# Altium schematic sheet Sheet1.SchDoc
size A
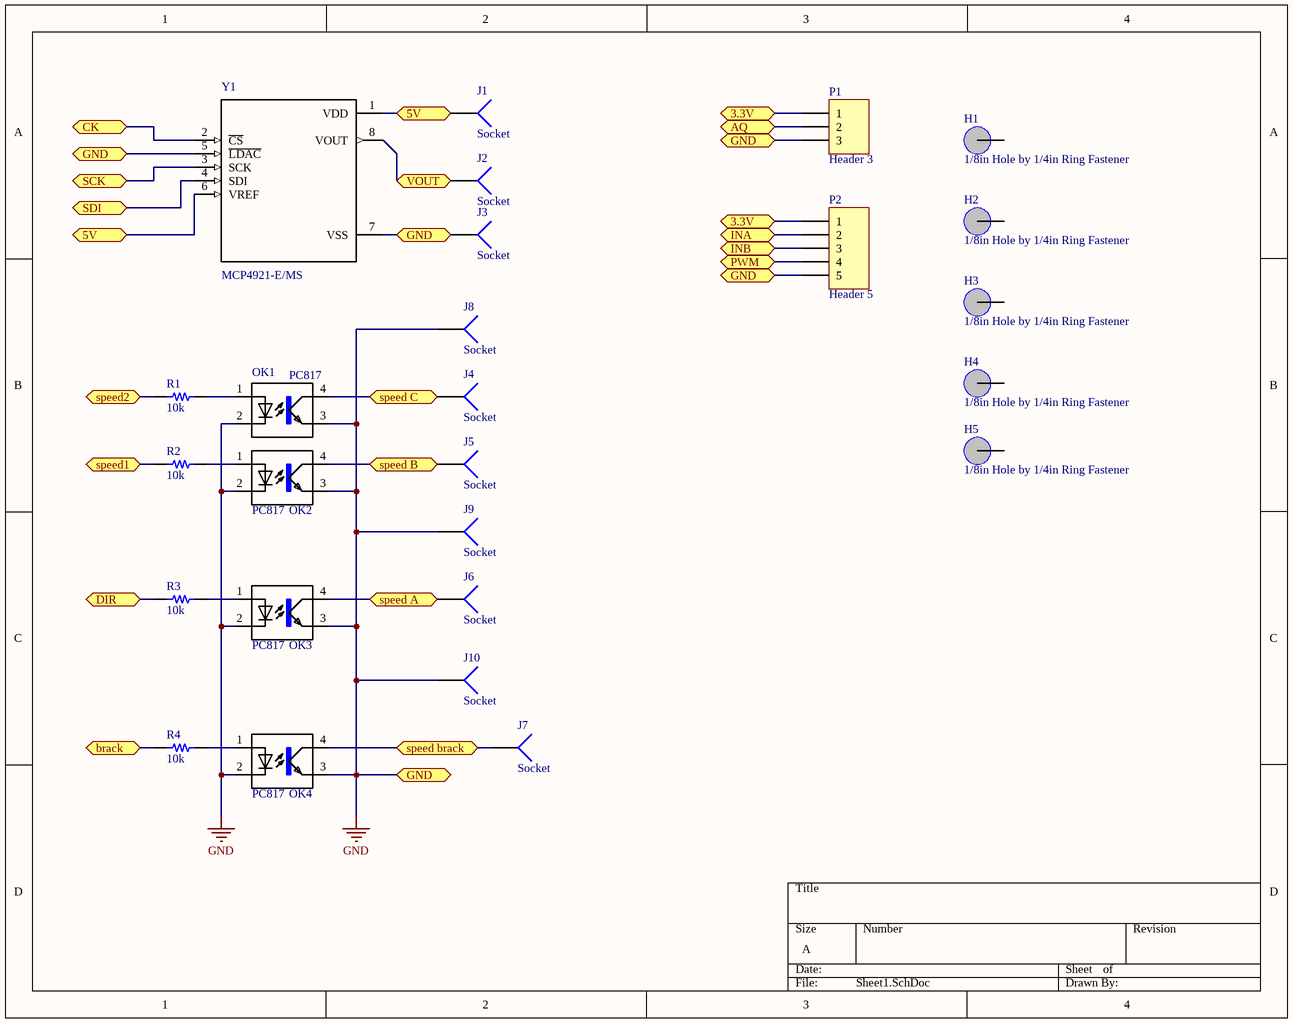
[diagram p0: Sheet1.SchDoc]

## Parts
H1  1/8in Hole by 1/4in Ring Fastener  [1/8in Fastener Hole]
H2  1/8in Hole by 1/4in Ring Fastener  [1/8in Fastener Hole]
H3  1/8in Hole by 1/4in Ring Fastener  [1/8in Fastener Hole]
H4  1/8in Hole by 1/4in Ring Fastener  [1/8in Fastener Hole]
H5  1/8in Hole by 1/4in Ring Fastener  [1/8in Fastener Hole]
J1  Socket  [PIN1]
J2  Socket  [PIN1]
J3  Socket  [PIN1]
J4  Socket  [PIN1]
J5  Socket  [PIN1]
J6  Socket  [PIN1]
J7  Socket  [PIN1]
J8  Socket  [PIN1]
J9  Socket  [PIN1]
J10  Socket  [PIN1]
OK1  PC817  [LITEON LTV-817]
OK2  PC817  [LITEON LTV-817]
OK3  PC817  [LITEON LTV-817]
OK4  PC817  [LITEON LTV-817]
P1  Header 3  [HDR1X3]
P2  Header 5  [HDR1X5]
R1  10k  [0805R-220]
R2  10k  [0805R-220]
R3  10k  [0805R-220]
R4  10k  [0805R-220]
Y1  MCP4921-E/MS  [SOIC127P600X175-8L]

## Ports
3.3V (bidir), 5V (bidir), AQ (bidir), brack (bidir), CK (bidir), DIR (bidir), GND (bidir), INA (bidir), INB (bidir), PWM (bidir), SCK (bidir), SDI (bidir), speed1 (bidir), speed2 (bidir), speed A (bidir), speed B (bidir), speed brack (bidir), speed C (bidir), VOUT (bidir)

## Nets
GND: J3.1 J8.1 J9.1 J10.1 OK1.2(C) OK1.3(EMIT) OK2.2(C) OK2.3(EMIT) OK3.2(C) OK3.3(EMIT) OK4.2(C) OK4.3(EMIT) P1.3 P2.5 Y1.5(~{LDAC}) Y1.7(VSS) ; port GND
3.3V: P1.1 P2.1 ; port 3.3V
5V: J1.1 Y1.1(VDD) Y1.6(VREF) ; port 5V
AQ: P1.2 ; port AQ
brack: R4.2 ; port brack
CK: Y1.2(~{CS}) ; port CK
DIR: R3.2 ; port DIR
INA: P2.2 ; port INA
INB: P2.3 ; port INB
PWM: P2.4 ; port PWM
SCK: Y1.3(SCK) ; port SCK
SDI: Y1.4(SDI) ; port SDI
speed1: R2.2 ; port speed1
speed2: R1.2 ; port speed2
speed A: J6.1 OK3.4(COL) ; port speed A
speed B: J5.1 OK2.4(COL) ; port speed B
speed brack: J7.1 OK4.4(COL) ; port speed brack
speed C: J4.1 OK1.4(COL) ; port speed C
VOUT: J2.1 Y1.8(VOUT) ; port VOUT
NetOK1_1: OK1.1(A) R1.1
NetOK2_1: OK2.1(A) R2.1
NetOK3_1: OK3.1(A) R3.1
NetOK4_1: OK4.1(A) R4.1

Not connected (* = marked no-connect by the designer): H1 1; H2 1; H3 1; H4 1; H5 1

## Library data of the parts
H1-H5 = 1/8in by 1/4in Fastner Hole
OK1-OK4 = PC817: Optocoupler DC-IN 1-CH Transistor DC-OUT 4-Pin PDIP Sleeve; MF: Sharp Microelectronics; Price: None; MP: PC817; Package: SMD-4 Sharp Microelectronics; SnapEDA_Link: https://www.snapeda.com/parts/PC817/Sharp%20Microelectronics/view-part/?ref=snap; Availability: Unavailable; Value: *
P1 = Header 3: Header, 3-Pin; LatestRevisionDate: 17-Jul-2002; LatestRevisionNote: Re-released for DXP Platform.; Publisher: Altium Limited
P2 = Header 5: Header, 5-Pin; LatestRevisionDate: 17-Jul-2002; LatestRevisionNote: Re-released for DXP Platform.; Publisher: Altium Limited
R1-R4 = Resistor: SMT Resistor; Value: 1K
Y1 = MCP4921-E/MS: MCP4921 Series 1 Ch 12-Bit Voltage Output Digital-to-Analog Converter-MSOP-8; MF: Microchip; Price: None; MP: MCP4921-E/MS; Package: MSOP-8 Microchip; SnapEDA_Link: https://www.snapeda.com/parts/MCP4921-E/MS/Microchip/view-part/?ref=snap; Availability: Unavailable; Value: *
J1-J10 = Socket: LatestRevisionDate: 17-Jul-2002; LatestRevisionNote: Re-released for DXP Platform.; Publisher: Altium Limited